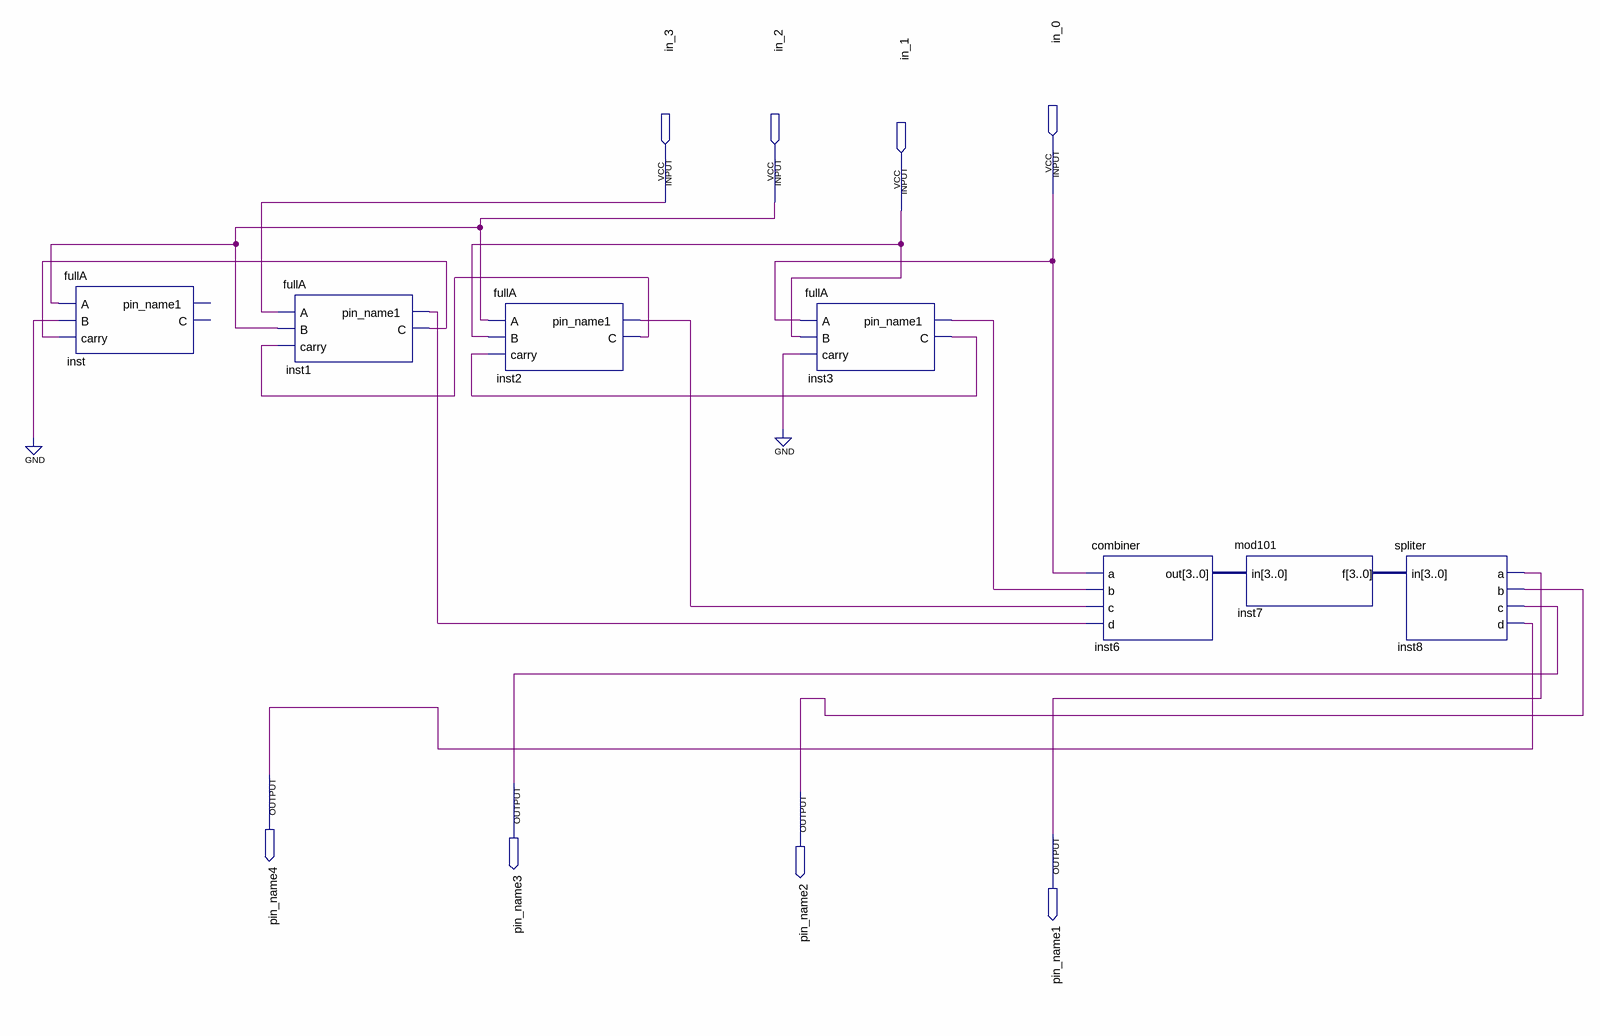
[diagram p0: schematic sheet]
// Quartus schematic mult.bdf as structural Verilog: 7 symbols, 8 pins
module mult (
  input  in_0,
  input  in_3,
  input  in_2,
  input  in_1,
  output pin_name4,
  output pin_name3,
  output pin_name2,
  output pin_name1
);

  wire inst1_c, inst1_pin_name1, inst2_c, inst2_pin_name1, inst3_c, inst3_pin_name1;
  wire [3:0] inst6_out, inst7_f;

  fullA inst (.A(in_2), .B(1'b0), .carry(inst1_c));  // open: pin_name1, C
  fullA inst1 (.A(in_3), .B(in_2), .carry(inst2_c), .pin_name1(inst1_pin_name1), .C(inst1_c));
  fullA inst2 (.A(in_2), .B(in_1), .carry(inst3_c), .pin_name1(inst2_pin_name1), .C(inst2_c));
  fullA inst3 (.A(in_0), .B(in_1), .carry(1'b0), .pin_name1(inst3_pin_name1), .C(inst3_c));
  combiner inst6 (.a(in_0), .b(inst3_pin_name1), .c(inst2_pin_name1), .d(inst1_pin_name1), .out(inst6_out));
  mod101 inst7 (.in(inst6_out), .f(inst7_f));
  spliter inst8 (.in(inst7_f), .a(pin_name1), .b(pin_name2), .c(pin_name3), .d(pin_name4));
endmodule
